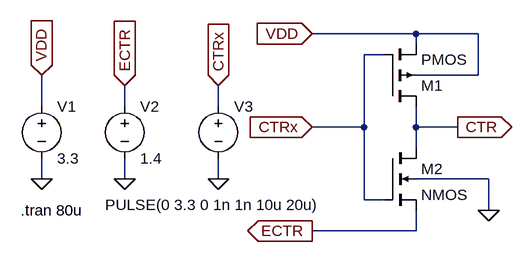
[diagram p0: schematic RDR controle.asc]
RDR controle.asc, the LTspice schematic file:
Version 4
SHEET 1 1124 680
WIRE 304 -32 144 -32
WIRE 400 -32 304 -32
WIRE 304 -16 304 -32
WIRE 256 0 224 0
WIRE 400 32 400 -32
WIRE 400 32 304 32
WIRE -272 80 -272 32
WIRE -144 80 -144 48
WIRE 0 80 0 48
WIRE 224 112 224 0
WIRE 224 112 144 112
WIRE 304 112 304 80
WIRE 368 112 304 112
WIRE 304 144 304 112
WIRE -272 192 -272 160
WIRE -144 192 -144 160
WIRE 0 192 0 160
WIRE 416 192 304 192
WIRE 224 224 224 112
WIRE 256 224 224 224
WIRE 416 240 416 192
WIRE 304 272 304 240
WIRE 304 272 144 272
FLAG 416 240 0
FLAG 368 112 CTR
IOPIN 368 112 Out
FLAG 144 -32 VDD
IOPIN 144 -32 In
FLAG 144 112 CTRx
IOPIN 144 112 In
FLAG 144 272 ECTR
IOPIN 144 272 Out
FLAG -272 192 0
FLAG -272 32 VDD
IOPIN -272 32 In
FLAG -144 192 0
FLAG 0 192 0
FLAG -144 48 ECTR
IOPIN -144 48 In
FLAG 0 48 CTRx
IOPIN 0 48 In
SYMBOL pmos4 256 80 M180
SYMATTR InstName M1
SYMBOL nmos4 256 144 R0
SYMATTR InstName M2
SYMBOL voltage -272 64 R0
SYMATTR InstName V1
SYMATTR Value 3.3
SYMBOL voltage -144 64 R0
SYMATTR InstName V2
SYMATTR Value 1.4
SYMBOL voltage 0 64 R0
WINDOW 123 0 0 Left 2
WINDOW 39 0 0 Left 2
WINDOW 3 -174 168 Left 2
SYMATTR InstName V3
SYMATTR Value PULSE(0 3.3 0 1n 1n 10u 20u)
TEXT -304 240 Left 2 !.tran 80u

The netlist it stands for:
* RDR controle.asc
M1 CTR CTRx VDD VDD PMOS
M2 CTR CTRx ECTR 0 NMOS
V1 VDD 0 3.3
V2 ECTR 0 1.4
V3 CTRx 0 PULSE(0 3.3 0 1n 1n 10u 20u)
.model NMOS NMOS
.model PMOS PMOS
.lib standard.mos
.tran 80u
.backanno
.end